# EAGLE design 5403833B (EAGLE 6.6.0)
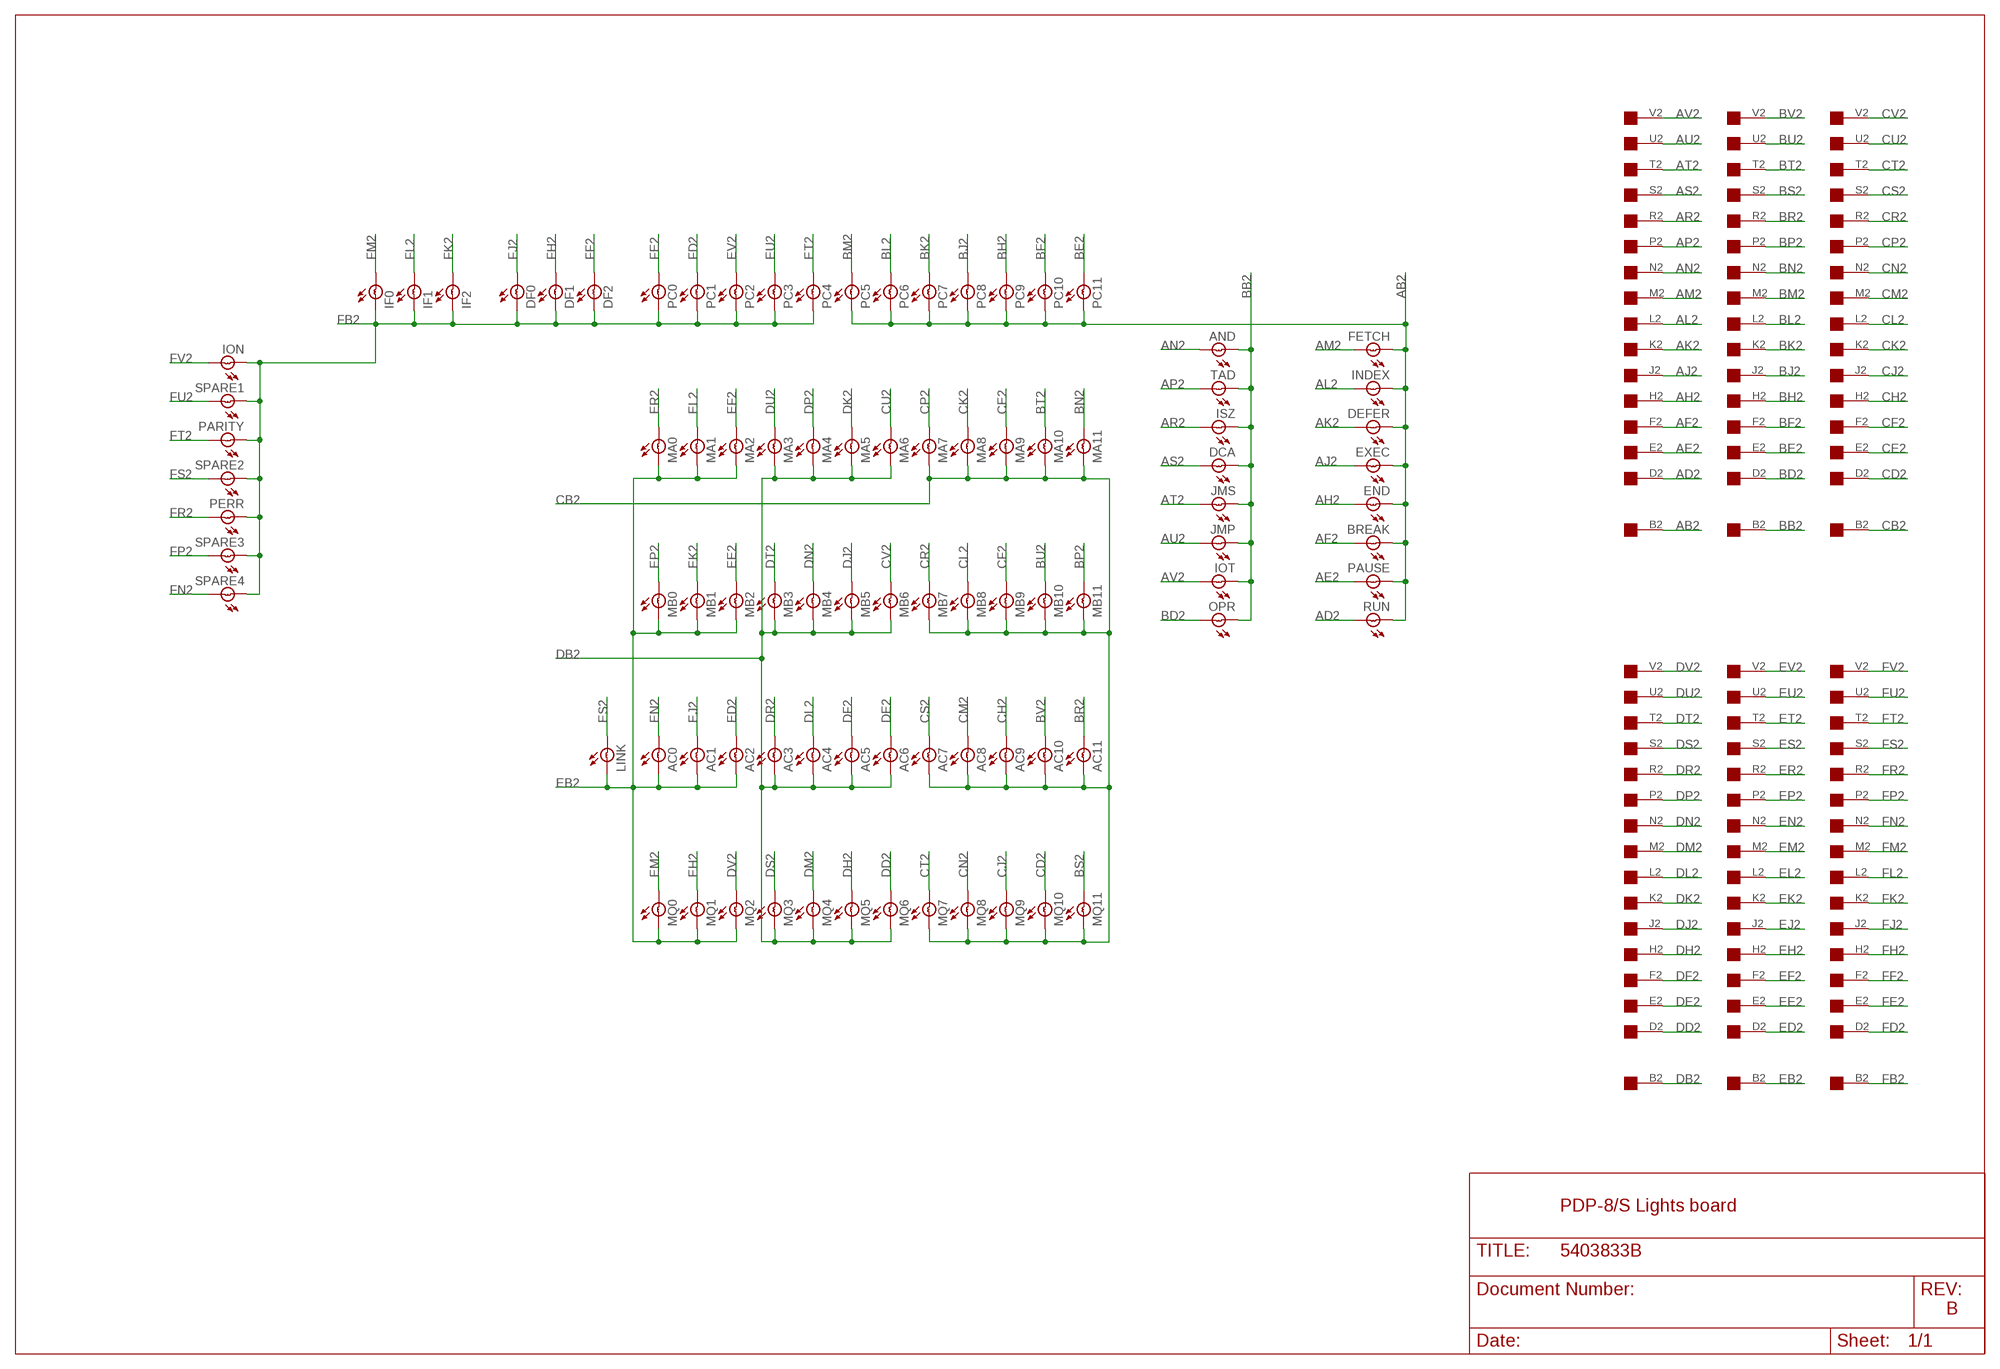
[diagram p0: schematic, sheet 1]

## Parts
A  EDGE-1  [EDGE-CON1]
AC0  BULB  [BULB]
AC1  BULB  [BULB]
AC2  BULB  [BULB]
AC3  BULB  [BULB]
AC4  BULB  [BULB]
AC5  BULB  [BULB]
AC6  BULB  [BULB]
AC7  BULB  [BULB]
AC8  BULB  [BULB]
AC9  BULB  [BULB]
AC10  BULB  [BULB]
AC11  BULB  [BULB]
AND  BULB  [BULB]
B  EDGE-1  [EDGE-CON1]
BREAK  BULB  [BULB]
C  EDGE-1  [EDGE-CON1]
D  EDGE-1  [EDGE-CON1]
DCA  BULB  [BULB]
DEFER  BULB  [BULB]
DF0  BULB  [BULB]
DF1  BULB  [BULB]
DF2  BULB  [BULB]
E  EDGE-1  [EDGE-CON1]
END  BULB  [BULB]
EXEC  BULB  [BULB]
F  EDGE-1  [EDGE-CON1]
FETCH  BULB  [BULB]
IF0  BULB  [BULB]
IF1  BULB  [BULB]
IF2  BULB  [BULB]
INDEX  BULB  [BULB]
ION  BULB  [BULB]
IOT  BULB  [BULB]
ISZ  BULB  [BULB]
JMP  BULB  [BULB]
JMS  BULB  [BULB]
LINK  BULB  [BULB]
MA0  BULB  [BULB]
MA1  BULB  [BULB]
MA2  BULB  [BULB]
MA3  BULB  [BULB]
MA4  BULB  [BULB]
MA5  BULB  [BULB]
MA6  BULB  [BULB]
MA7  BULB  [BULB]
MA8  BULB  [BULB]
MA9  BULB  [BULB]
MA10  BULB  [BULB]
MA11  BULB  [BULB]
MB0  BULB  [BULB]
MB1  BULB  [BULB]
MB2  BULB  [BULB]
MB3  BULB  [BULB]
MB4  BULB  [BULB]
MB5  BULB  [BULB]
MB6  BULB  [BULB]
MB7  BULB  [BULB]
MB8  BULB  [BULB]
MB9  BULB  [BULB]
MB10  BULB  [BULB]
MB11  BULB  [BULB]
MQ0  BULB  [BULB]
MQ1  BULB  [BULB]
MQ2  BULB  [BULB]
MQ3  BULB  [BULB]
MQ4  BULB  [BULB]
MQ5  BULB  [BULB]
MQ6  BULB  [BULB]
MQ7  BULB  [BULB]
MQ8  BULB  [BULB]
MQ9  BULB  [BULB]
MQ10  BULB  [BULB]
MQ11  BULB  [BULB]
OPR  BULB  [BULB]
PARITY  BULB  [BULB]
PAUSE  BULB  [BULB]
PC0  BULB  [BULB]
PC1  BULB  [BULB]
PC2  BULB  [BULB]
PC3  BULB  [BULB]
PC4  BULB  [BULB]
PC5  BULB  [BULB]
PC6  BULB  [BULB]
PC7  BULB  [BULB]
PC8  BULB  [BULB]
PC9  BULB  [BULB]
PC10  BULB  [BULB]
PC11  BULB  [BULB]
PERR  BULB  [BULB]
RUN  BULB  [BULB]
SPARE1  BULB  [BULB]
SPARE2  BULB  [BULB]
SPARE3  BULB  [BULB]
SPARE4  BULB  [BULB]
TAD  BULB  [BULB]

## Nets
AB2: A.B2 BREAK.B DEFER.B END.B EXEC.B FETCH.B INDEX.B PAUSE.B PC5.B PC6.B PC7.B PC8.B PC9.B PC10.B PC11.B RUN.B
AD2: A.D2 RUN.A
AE2: A.E2 PAUSE.A
AF2: A.F2 BREAK.A
AH2: A.H2 END.A
AJ2: A.J2 EXEC.A
AK2: A.K2 DEFER.A
AL2: A.L2 INDEX.A
AM2: A.M2 FETCH.A
AN2: A.N2 AND.A
AP2: A.P2 TAD.A
AR2: A.R2 ISZ.A
AS2: A.S2 DCA.A
AT2: A.T2 JMS.A
AU2: A.U2 JMP.A
AV2: A.V2 IOT.A
BB2: AND.B B.B2 DCA.B IOT.B ISZ.B JMP.B JMS.B OPR.B TAD.B
BD2: B.D2 OPR.A
BE2: B.E2 PC11.A
BF2: B.F2 PC10.A
BH2: B.H2 PC9.A
BJ2: B.J2 PC8.A
BK2: B.K2 PC7.A
BL2: B.L2 PC6.A
BM2: B.M2 PC5.A
BN2: B.N2 MA11.A
BP2: B.P2 MB11.A
BR2: AC11.A B.R2
BS2: B.S2 MQ11.A
BT2: B.T2 MA10.A
BU2: B.U2 MB10.A
BV2: AC10.A B.V2
CB2: AC7.B AC8.B AC9.B AC10.B AC11.B C.B2 MA7.B MA8.B MA9.B MA10.B MA11.B MB7.B MB8.B MB9.B MB10.B MB11.B MQ7.B MQ8.B MQ9.B MQ10.B MQ11.B
CD2: C.D2 MQ10.A
CE2: C.E2 MA9.A
CF2: C.F2 MB9.A
CH2: AC9.A C.H2
CJ2: C.J2 MQ9.A
CK2: C.K2 MA8.A
CL2: C.L2 MB8.A
CM2: AC8.A C.M2
CN2: C.N2 MQ8.A
CP2: C.P2 MA7.A
CR2: C.R2 MB7.A
CS2: AC7.A C.S2
CT2: C.T2 MQ7.A
CU2: C.U2 MA6.A
CV2: C.V2 MB6.A
DB2: AC3.B AC4.B AC5.B AC6.B D.B2 MA3.B MA4.B MA5.B MA6.B MB3.B MB4.B MB5.B MB6.B MQ3.B MQ4.B MQ5.B MQ6.B
DD2: D.D2 MQ6.A
DE2: AC6.A D.E2
DF2: AC5.A D.F2
DH2: D.H2 MQ5.A
DJ2: D.J2 MB5.A
DK2: D.K2 MA5.A
DL2: AC4.A D.L2
DM2: D.M2 MQ4.A
DN2: D.N2 MB4.A
DP2: D.P2 MA4.A
DR2: AC3.A D.R2
DS2: D.S2 MQ3.A
DT2: D.T2 MB3.A
DU2: D.U2 MA3.A
DV2: D.V2 MQ2.A
EB2: AC0.B AC1.B AC2.B E.B2 LINK.B MA0.B MA1.B MA2.B MB0.B MB1.B MB2.B MQ0.B MQ1.B MQ2.B
ED2: AC2.A E.D2
EE2: E.E2 MB2.A
EF2: E.F2 MA2.A
EH2: E.H2 MQ1.A
EJ2: AC1.A E.J2
EK2: E.K2 MB1.A
EL2: E.L2 MA1.A
EM2: E.M2 MQ0.A
EN2: AC0.A E.N2
EP2: E.P2 MB0.A
ER2: E.R2 MA0.A
ES2: E.S2 LINK.A
ET2: E.T2 PC4.A
EU2: E.U2 PC3.A
EV2: E.V2 PC2.A
FB2: DF0.B DF1.B DF2.B F.B2 IF0.B IF1.B IF2.B ION.B PARITY.B PC0.B PC1.B PC2.B PC3.B PC4.B PERR.B SPARE1.B SPARE2.B SPARE3.B SPARE4.B
FD2: F.D2 PC1.A
FE2: F.E2 PC0.A
FF2: DF2.A F.F2
FH2: DF1.A F.H2
FJ2: DF0.A F.J2
FK2: F.K2 IF2.A
FL2: F.L2 IF1.A
FM2: F.M2 IF0.A
FN2: F.N2 SPARE4.A
FP2: F.P2 SPARE3.A
FR2: F.R2 PERR.A
FS2: F.S2 SPARE2.A
FT2: F.T2 PARITY.A
FU2: F.U2 SPARE1.A
FV2: F.V2 ION.A
Unconnected: A.A2 A.C2 B.A2 B.C2 C.A2 C.C2 D.A2 D.C2 E.A2 E.C2 F.A2 F.C2

## Notes on the sheet
- PDP-8/S Lights board
- B

## Library data of the parts
A B C D E F = dec-con:EDGE-1: Single-Sided DEC Edge Connector -- (side 2)
AC0 AC1-AC11 AND BREAK DCA DEFER DF0 DF1 DF2 END EXEC FETCH IF0 IF1 IF2 INDEX ION IOT ISZ JMP JMS LINK MA0 MA1-MA11 MB0 MB1-MB11 MQ0 MQ1-MQ11 OPR PARITY PAUSE PC0 PC1-PC11 PERR RUN SPARE1-SPARE4 TAD = dec-con:BULB: T 1 3/4 Bulb

## Net classes
0 default: width 0.813 mm

## Board
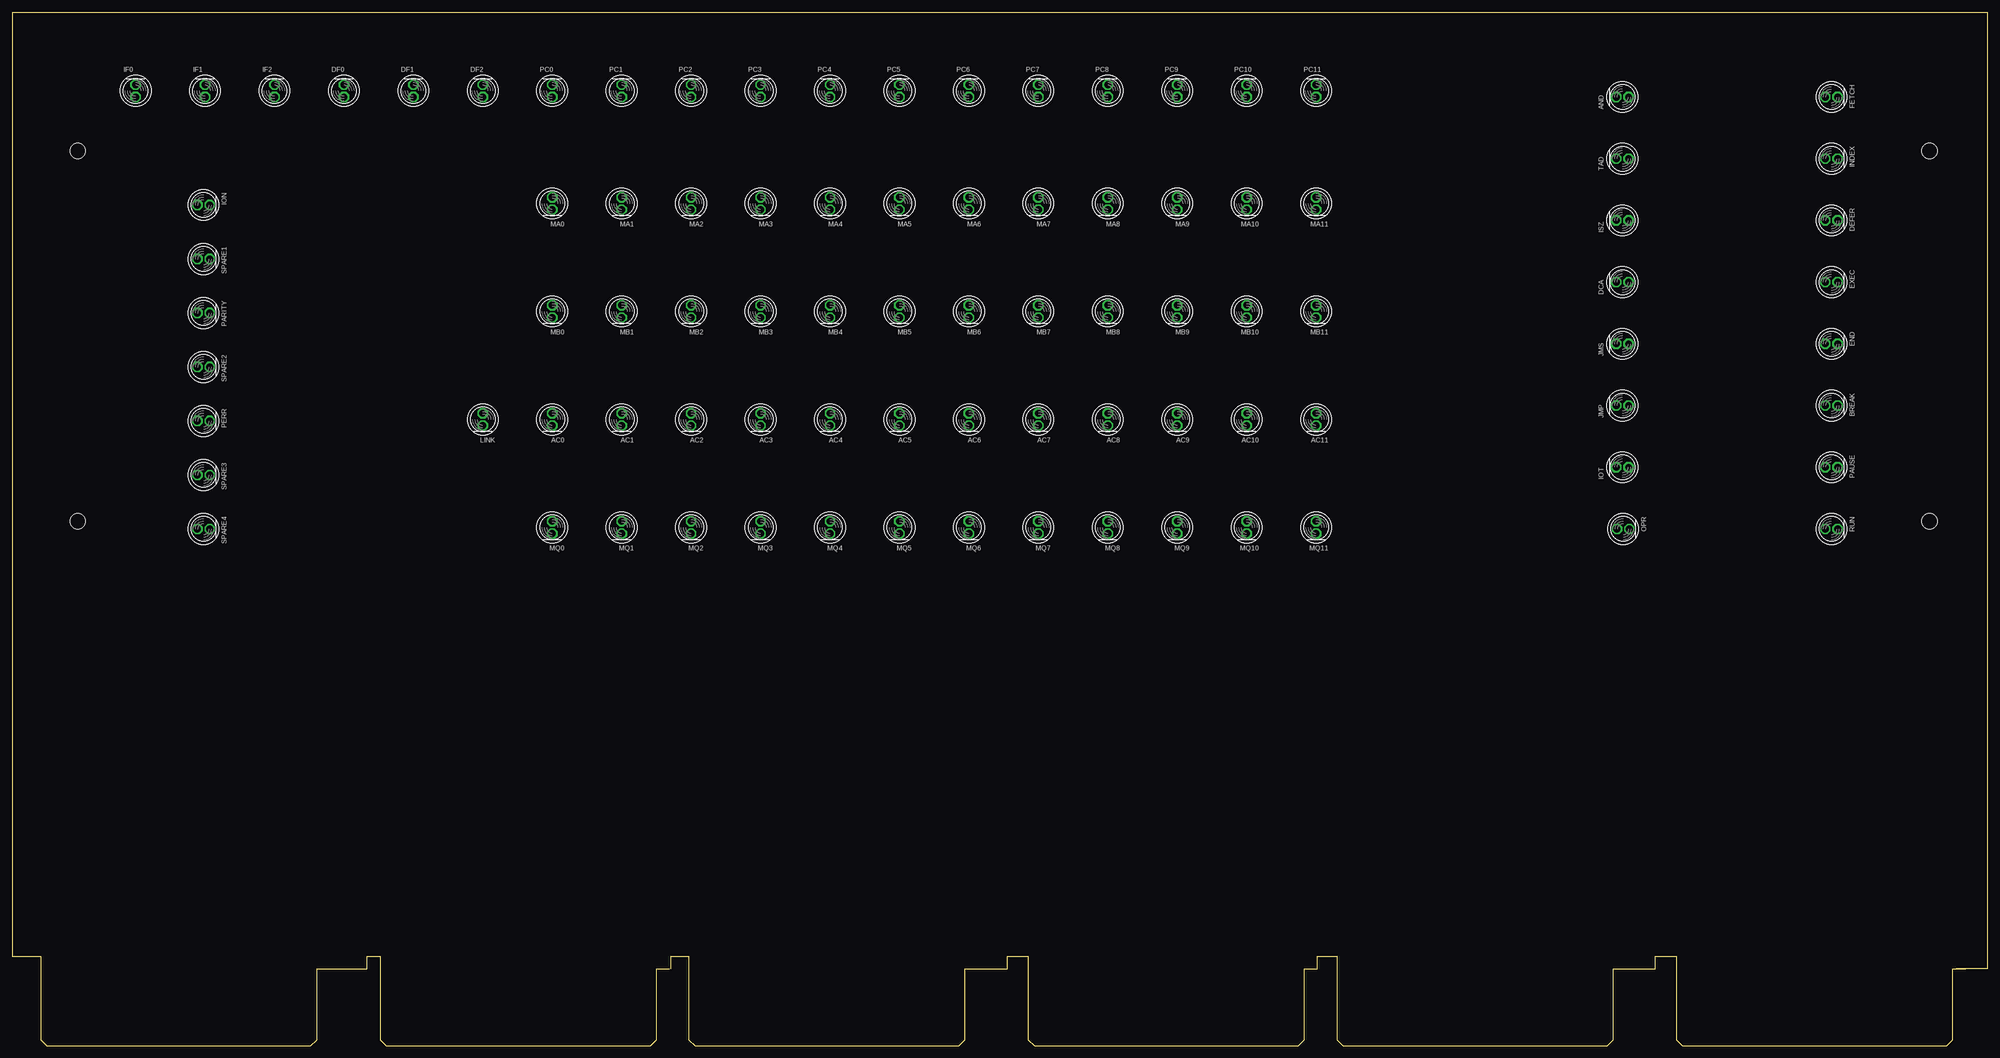
[diagram p1: board, top side]
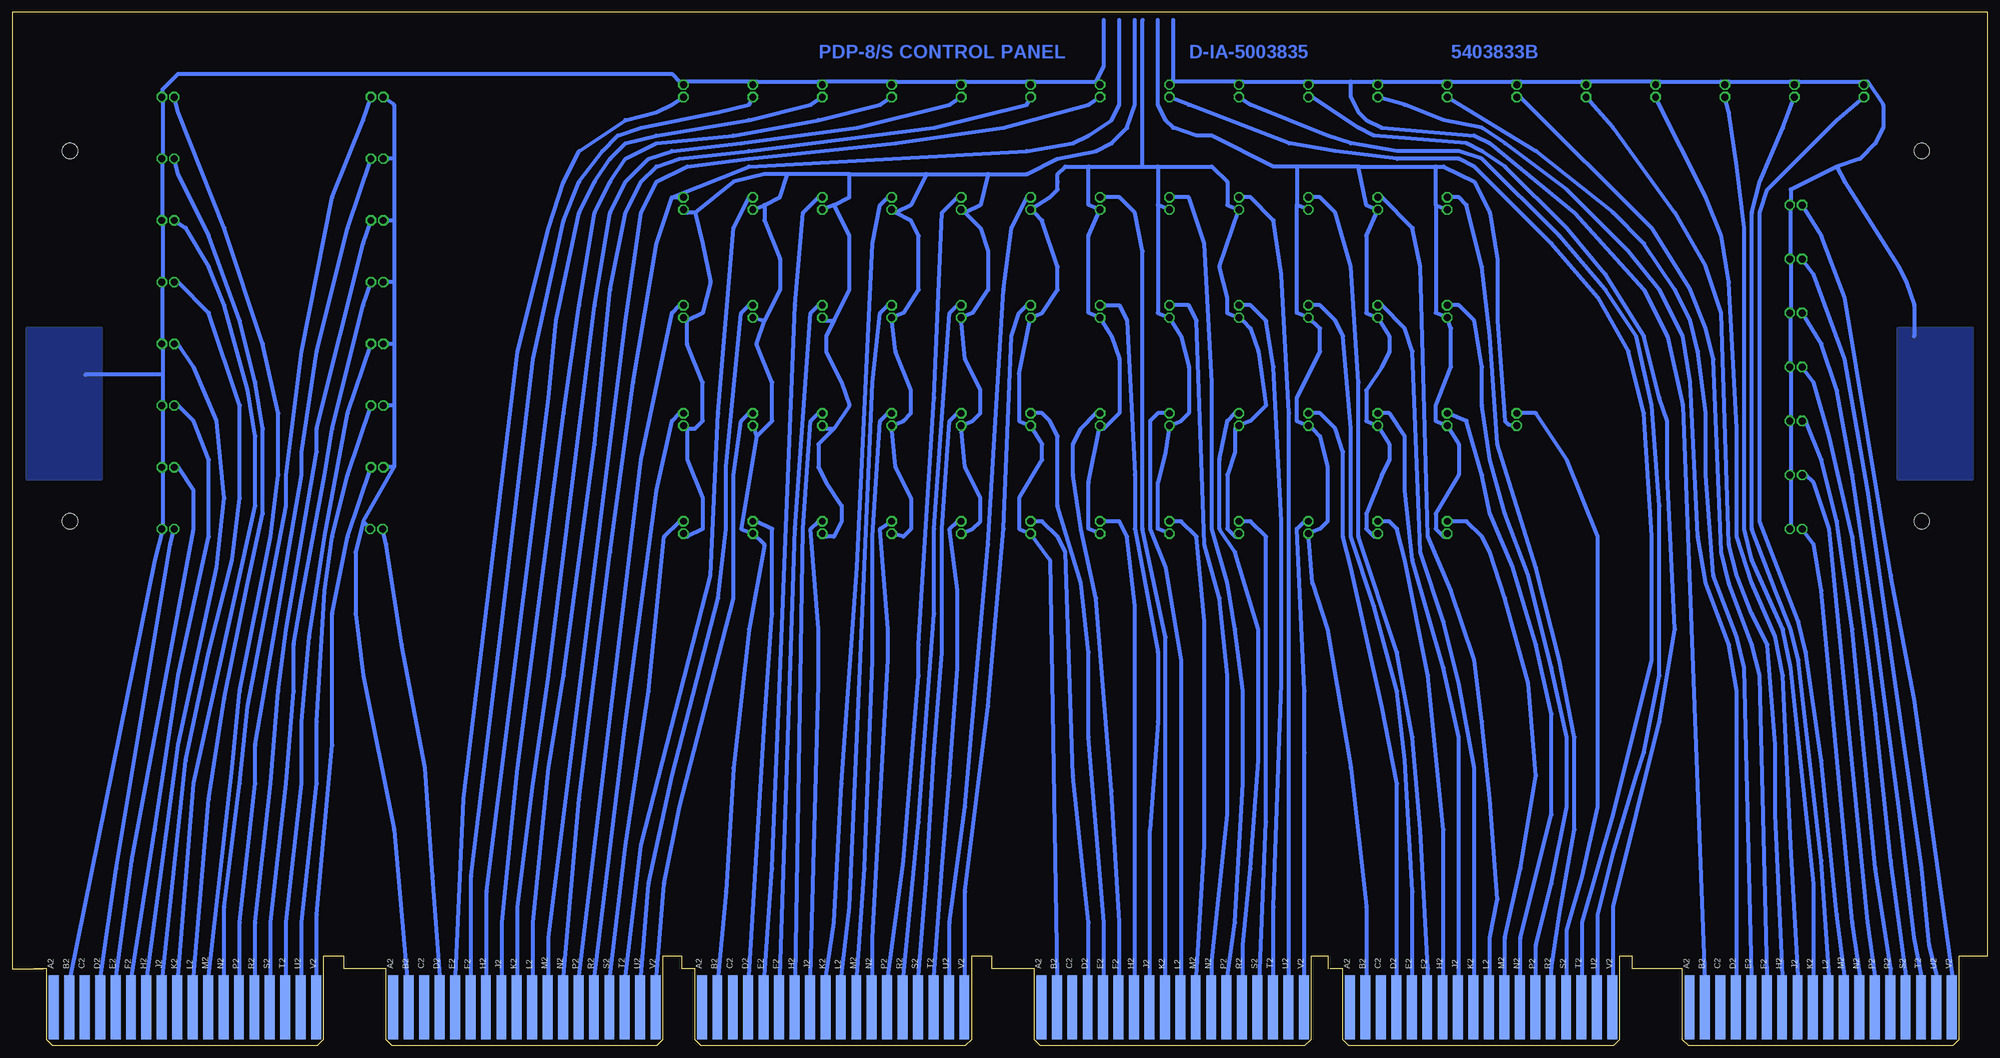
[diagram p2: board, bottom side, seen from below]

Size 406.4 x 212.72 mm. Coordinates in mm from the lower left corner, seen from the top.
Outline: 400.05,15.88 406.4,15.88 406.4,212.72 0,212.72 0,18.41 4.76,18.41
Outline: 138.11,18.41 135.57,18.41 135.57,15.88
Outline: 207.33,18.41 204.79,18.41 204.79,15.88 198.44,15.88
Outline: 270.83,18.41 268.6,18.41 268.6,15.88
Outline: 340.68,18.41 338.14,18.41 338.14,15.88 331.79,15.88
Outline: 73.34,18.41 73.02,18.41 73.02,15.88 65.09,15.88
Copper layers (1+16): Top 0.035mm / dielectric 1.5mm / Bottom 0.035mm
Design rules "16mils *": minimum track width 16mil, minimum drill 32mil, track to track 15mil, track to pad 10mil, pad to pad 10mil, via to via 10mil, smd to smd 10mil, copper to edge 13mil, drill to drill 10mil, minimum pad ring 10mil, minimum via ring 8mil, stop-mask expansion 0mil, vias tented up to drill 0mil, thermal gap 10mil
Holes 3.17 mm at 13.49,107.95 13.49,184.15 394.49,184.15 394.49,107.95

### Footprints (pad centres in the part's own frame; a part is rotated, then mirrored left to right if it is on the bottom)
EDGE-CON1 = smd 13.106 x 2.032 bottom: A2 7.938,4.128; B2 7.938,7.303; C2 7.938,10.477; D2 7.938,13.652; E2 7.938,16.828; F2 7.938,20.003; H2 7.938,23.177; J2 7.938,26.352; K2 7.938,29.527; L2 7.938,32.703; M2 7.938,35.877; N2 7.938,39.053; P2 7.938,42.227; R2 7.938,45.403; S2 7.938,48.578; T2 7.938,51.752; U2 7.938,54.928; V2 7.938,58.102
BULB = drill 1.422 octagon: A 0,0; B 0,2.54

### Placement (x,y rotation side)
A  401.95,0 90 top
AC0  111.12,130.18 180 top
AC1  125.41,130.18 180 top
AC2  139.7,130.18 180 top
AC3  153.99,130.18 180 top
AC4  168.27,130.18 180 top
AC5  182.56,130.18 180 top
AC6  196.85,130.18 180 top
AC7  211.14,130.18 180 top
AC8  225.42,130.18 180 top
AC9  239.71,130.18 180 top
AC10  254,130.18 180 top
AC11  268.29,130.18 180 top
AND  332.58,195.26 90 top
B  332.1,0 90 top
BREAK  373.06,131.76 270 top
C  268.6,0 90 top
D  198.75,0 90 top
DCA  332.58,157.16 90 top
DEFER  373.06,169.86 270 top
DF0  68.26,195.26 0 top
DF1  82.55,195.26 0 top
DF2  96.84,195.26 0 top
E  135.25,0 90 top
END  373.06,144.46 270 top
EXEC  373.06,157.16 270 top
F  65.41,0 90 top
FETCH  373.06,195.26 270 top
IF0  25.4,195.26 0 top
IF1  39.69,195.26 0 top
IF2  53.98,195.26 0 top
INDEX  373.06,182.56 270 top
ION  38.1,173.04 270 top
IOT  332.58,119.06 90 top
ISZ  332.58,169.86 90 top
JMP  332.58,131.76 90 top
JMS  332.58,144.46 90 top
LINK  96.84,130.18 180 top
MA0  111.12,174.62 180 top
MA1  125.41,174.62 180 top
MA2  139.7,174.62 180 top
MA3  153.99,174.62 180 top
MA4  168.27,174.62 180 top
MA5  182.56,174.62 180 top
MA6  196.85,174.62 180 top
MA7  211.14,174.62 180 top
MA8  225.42,174.62 180 top
MA9  239.71,174.62 180 top
MA10  254,174.62 180 top
MA11  268.29,174.62 180 top
MB0  111.12,152.4 180 top
MB1  125.41,152.4 180 top
MB2  139.7,152.4 180 top
MB3  153.99,152.4 180 top
MB4  168.27,152.4 180 top
MB5  182.56,152.4 180 top
MB6  196.85,152.4 180 top
MB7  211.14,152.4 180 top
MB8  225.42,152.4 180 top
MB9  239.71,152.4 180 top
MB10  254,152.4 180 top
MB11  268.29,152.4 180 top
MQ0  111.12,107.95 180 top
MQ1  125.41,107.95 180 top
MQ2  139.7,107.95 180 top
MQ3  153.99,107.95 180 top
MQ4  168.27,107.95 180 top
MQ5  182.56,107.95 180 top
MQ6  196.85,107.95 180 top
MQ7  211.14,107.95 180 top
MQ8  225.42,107.95 180 top
MQ9  239.71,107.95 180 top
MQ10  254,107.95 180 top
MQ11  268.29,107.95 180 top
OPR  330.2,106.36 270 top
PARITY  38.1,150.81 270 top
PAUSE  373.06,119.06 270 top
PC0  111.12,195.26 0 top
PC1  125.41,195.26 0 top
PC2  139.7,195.26 0 top
PC3  153.99,195.26 0 top
PC4  168.27,195.26 0 top
PC5  182.56,195.26 0 top
PC6  196.85,195.26 0 top
PC7  211.14,195.26 0 top
PC8  225.42,195.26 0 top
PC9  239.71,195.26 0 top
PC10  254,195.26 0 top
PC11  268.29,195.26 0 top
PERR  38.1,128.59 270 top
RUN  373.06,106.36 270 top
SPARE1  38.1,161.93 270 top
SPARE2  38.1,139.7 270 top
SPARE3  38.1,117.47 270 top
SPARE4  38.1,106.36 270 top
TAD  332.58,182.56 90 top

### Tracks (layer width: path | path; a pad name or v marks a point on that pad's centre or on a via)
AB2
  Bottom 0.813: 183.36,198.44 196.06,198.44 PC6.B 197.64,198.44 210.34,198.44 PC7.B 211.93,198.44 224.63,198.44 PC8.B 226.22,198.44 238.92,198.44 PC9.B 240.51,198.44 253.21,198.44 PC10.B 254.79,198.44 267.49,198.44 PC11.B 269.08,198.44 270.67,200.03 372.27,200.03 375.44,196.85 375.44,195.26 | 183.36,198.44 PC5.B | 375.44,195.26 375.44,182.56 | 375.44,169.86 375.44,157.16 | 375.44,119.06 375.44,106.36 | 375.44,144.46 375.44,138.11 | 375.44,138.11 375.44,131.76 | 375.44,131.76 375.44,119.06 | 375.44,119.06 PAUSE.B | 375.44,131.76 BREAK.B | 375.44,144.46 375.44,157.16 | 375.44,157.16 EXEC.B | 375.44,144.46 END.B | 375.44,169.86 375.44,182.56 | 375.44,182.56 INDEX.B | 375.44,169.86 DEFER.B | 375.44,106.36 377.03,100.01 394.49,14.29 394.49,7.94 A.B2 | 375.44,106.36 RUN.B | 375.44,195.26 FETCH.B | 183.36,198.44 181.77,201.61 181.77,211.14 | 375.44,138.11 391.32,138.11
  pour Bottom: 388.14,116.68 403.22,116.68 403.22,147.64 388.14,147.64
AD2
  Bottom 0.813: RUN.A 373.86,103.19 384.97,36.51 388.14,14.29 388.14,7.94 A.D2
AE2
  Bottom 0.813: PAUSE.A 372.27,119.06 369.09,114.3 369.09,106.36 381.79,38.1 384.97,14.29 384.97,7.94 A.E2
AF2
  Bottom 0.813: BREAK.A 372.27,131.76 369.09,128.59 365.92,120.65 365.92,104.78 372.27,76.2 377.03,44.45 381.79,14.29 381.79,7.94 A.F2
AH2
  Bottom 0.813: END.A 372.27,144.46 369.09,139.7 364.33,128.59 362.74,112.71 364.33,98.42 372.27,61.91 378.62,14.29 378.62,7.94 A.H2
AJ2
  Bottom 0.813: EXEC.A 372.27,157.16 365.92,150.81 359.57,131.76 359.57,112.71 361.16,100.01 365.92,80.96 370.68,58.74 375.44,14.29 375.44,7.94 A.J2
AK2
  Bottom 0.813: DEFER.A 370.68,168.28 365.92,160.34 362.74,152.4 357.98,134.94 356.39,125.41 356.39,111.12 369.09,53.98 372.27,14.29 372.27,7.94 A.K2
AL2
  Bottom 0.813: INDEX.A 372.27,179.39 365.92,166.69 359.57,149.22 356.39,136.53 354.81,127 354.81,109.54 357.98,95.25 362.74,71.44 365.92,50.8 369.09,14.29 369.09,7.94 A.L2
AM2
  Bottom 0.813: FETCH.A 372.27,192.09 362.74,168.28 354.81,144.46 351.63,130.18 351.63,117.47 353.22,104.78 359.57,73.03 361.16,57.15 365.92,14.29 365.92,7.94 A.M2
AN2
  Bottom 0.813: AND.A 334.17,190.5 340.52,174.62 346.87,142.88 350.04,117.47 350.04,111.12 357.98,69.85 359.57,53.98 362.74,28.57 362.74,7.94 A.N2
AP2
  Bottom 0.813: A.P2 359.57,9.53 359.57,25.4 356.39,53.98 356.39,61.91 346.87,117.47 346.87,122.24 343.69,142.88 337.34,168.28 TAD.A
AR2
  Bottom 0.813: ISZ.A 334.17,165.1 343.69,127 343.69,122.24 350.04,85.72 351.63,73.03 353.22,53.98 356.39,25.4 356.39,7.94 A.R2
AS2
  Bottom 0.813: DCA.A 334.17,152.4 340.52,127 342.11,117.47 346.87,92.08 348.46,82.55 348.46,73.03 350.04,53.98 353.22,25.4 353.22,7.94 A.S2
AT2
  Bottom 0.813: JMS.A 337.34,130.18 342.11,104.78 345.28,84.14 346.87,66.67 346.87,53.98 350.04,25.4 350.04,7.94 A.T2
AU2
  Bottom 0.813: JMP.A 337.34,117.47 340.52,104.78 342.11,93.66 343.69,66.67 343.69,53.98 346.87,25.4 346.87,7.94 A.U2
AV2
  Bottom 0.813: IOT.A 337.34,104.78 340.52,88.9 340.52,61.91 343.69,26.99 343.69,7.94 A.V2
BB2
  Bottom 0.813: AND.B 327.82,193.68 327.82,182.56 | 327.82,182.56 327.82,169.86 | 327.82,119.06 334.17,107.95 | 327.82,169.86 327.82,157.16 | 327.82,157.16 327.82,144.46 | 327.82,144.46 327.82,131.76 | 327.82,131.76 327.82,119.06 | 327.82,119.06 IOT.B | 327.82,131.76 JMP.B | 327.82,144.46 JMS.B | 327.82,157.16 DCA.B | 327.82,169.86 ISZ.B | 334.17,107.95 332.58,106.36 OPR.B | 334.17,107.95 335.76,101.6 335.76,88.9 334.17,76.2 327.82,44.45 324.64,7.94 B.B2 | 327.82,182.56 TAD.B
BD2
  Bottom 0.813: OPR.A 329.41,103.19 326.23,82.55 321.47,57.15 319.88,34.92 318.29,14.29 318.29,7.94 B.D2
BE2
  Bottom 0.813: PC11.A 270.67,193.68 273.84,192.09 280.19,190.5 289.72,184.15 292.89,177.8 296.07,168.28 302.42,142.88 313.53,50.8 315.12,14.29 315.12,7.94 B.E2
BF2
  Bottom 0.813: PC10.A 254.79,193.68 261.14,192.09 277.02,188.91 281.78,187.32 284.96,184.15 289.72,177.8 292.89,169.86 299.24,141.29 305.59,87.31 311.94,34.92 311.94,7.94 B.F2
BH2
  Bottom 0.813: PC9.A 242.09,193.68 254.79,190.5 273.84,187.32 280.19,185.74 283.37,182.56 286.54,177.8 289.72,171.45 294.48,149.22 296.07,133.35 308.77,31.75 308.77,7.94 B.H2
BJ2
  Bottom 0.813: PC8.A 227.81,193.68 240.51,190.5 257.97,187.32 273.84,185.74 280.19,182.56 283.37,177.8 286.54,171.45 289.72,152.4 292.89,130.18 302.42,57.15 305.59,25.4 305.59,7.94 B.J2
BK2
  Bottom 0.813: B.K2 302.42,9.53 302.42,28.57 299.24,53.98 296.07,76.2 286.54,152.4 283.37,171.45 280.19,177.8 275.43,182.56 270.67,184.15 256.38,185.74 232.57,188.91 213.52,193.68 PC7.A
BL2
  Bottom 0.813: B.L2 299.24,9.53 299.24,25.4 296.07,57.15 292.89,76.2 286.54,123.83 283.37,155.57 280.19,171.45 277.02,177.8 273.84,180.97 269.08,182.56 254.79,184.15 216.69,188.91 197.64,193.68 PC6.A
BM2
  Bottom 0.813: B.M2 296.07,9.53 296.07,22.23 280.19,149.22 277.02,171.45 273.84,177.8 267.49,180.97 254.79,182.56 224.63,185.74 202.41,188.91 184.94,193.68 PC5.A
BN2
  Bottom 0.813: 270.67,174.62 273.84,165.1 278.61,136.53 283.37,101.6 289.72,50.8 292.89,14.29 292.89,7.94 B.N2 | 270.67,174.62 MA11.A | 270.67,174.62 254.79,180.97 197.64,184.15 188.12,185.74 184.94,187.32 180.18,190.5 178.59,193.68 178.59,211.14
BP2
  Bottom 0.813: MB11.A 269.08,152.4 270.67,150.81 277.02,120.65 289.72,14.29 289.72,7.94 B.P2
BR2
  Bottom 0.813: AC11.A 269.08,130.18 270.67,128.59 273.84,114.3 280.19,66.67 286.54,14.29 286.54,7.94 B.R2
BS2
  Bottom 0.813: MQ11.A 269.08,107.95 272.26,104.78 275.43,73.03 280.19,41.27 283.37,14.29 283.37,7.94 B.S2
BT2
  Bottom 0.813: MA10.A 254.79,174.62 257.97,168.28 261.14,130.18 262.73,96.84 277.02,41.27 280.19,14.29 280.19,7.94 B.T2
BU2
  Bottom 0.813: MB10.A 254.79,152.4 256.38,150.81 259.56,119.06 259.56,106.36 261.14,92.08 270.67,55.56 275.43,33.34 277.02,14.29 277.02,7.94 B.U2
BV2
  Bottom 0.813: AC10.A 254.79,130.18 256.38,128.59 257.97,117.47 257.97,92.08 269.08,49.21 272.26,33.34 273.84,14.29 273.84,7.94 B.V2
CB2
  Bottom 0.813: MQ8.B 223.04,104.78 221.46,106.36 221.46,112.71 224.63,119.06 AC8.B 223.04,128.59 221.46,130.18 221.46,134.94 224.63,142.88 MB8.B 223.04,150.81 219.87,155.57 219.87,166.69 221.46,169.86 224.63,171.45 | 253.21,125.41 256.38,106.36 MQ10.B 251.62,103.19 254.79,85.72 257.97,57.15 259.56,31.75 261.14,14.29 261.14,7.94 C.B2 | 237.33,127 240.51,123.83 240.51,119.06 238.92,115.89 235.74,111.12 235.74,107.95 237.33,104.78 238.92,104.78 MQ9.B | 237.33,127 238.92,127 AC9.B | 265.91,171.45 267.49,171.45 MA11.B | 237.33,149.22 238.92,146.05 238.92,142.88 235.74,136.53 234.16,131.76 237.33,127 | 237.33,149.22 238.92,149.22 MB9.B | MQ7.B 208.76,106.36 207.17,107.95 207.17,112.71 210.34,119.06 AC7.B 208.76,128.59 207.17,130.18 207.17,134.94 210.34,141.29 MB7.B 208.76,150.81 205.58,155.57 205.58,163.51 207.17,168.28 210.34,171.45 | 237.33,149.22 234.16,155.57 234.16,166.69 237.33,173.04 | 267.49,149.22 264.32,150.81 262.73,157.16 264.32,165.1 265.91,171.45 | 267.49,127 267.49,120.65 264.32,112.71 264.32,106.36 267.49,104.78 MQ11.B | 267.49,127 265.91,127 264.32,128.59 264.32,136.53 267.49,144.46 267.49,149.22 | 267.49,127 AC11.B | 267.49,149.22 MB11.B | 234.16,179.39 246.86,179.39 | 237.33,173.04 234.16,174.62 234.16,179.39 | 205.58,179.39 207.17,173.04 210.34,171.45 | 234.16,179.39 218.28,179.39 | 218.28,179.39 205.58,179.39 | 218.28,179.39 221.46,173.04 224.63,171.45 | 224.63,171.45 MA8.B | 251.62,149.22 253.21,144.46 250.03,136.53 250.03,128.59 253.21,125.41 | 265.91,171.45 257.97,177.8 251.62,179.39 246.86,179.39 | MA10.B 251.62,173.04 | 251.62,173.04 248.44,174.62 246.86,179.39
  Bottom 0.813: 237.33,173.04 MA9.B | 251.62,173.04 251.62,169.86 248.44,161.93 248.44,155.57 251.62,149.22 | MB10.B 251.62,149.22 | AC10.B 253.21,125.41 | 205.58,179.39 197.64,179.39 191.29,182.56 183.36,184.15 180.18,185.74 177.01,188.91 175.42,193.68 175.42,211.14 | 210.34,171.45 MA7.B
CD2
  Bottom 0.813: MQ10.A 253.21,107.95 250.03,106.36 250.03,88.9 251.62,66.67 254.79,14.29 254.79,7.94 C.D2
CE2
  Bottom 0.813: MA9.A 240.51,174.62 243.68,171.45 245.27,152.4 248.44,76.2 250.03,36.51 251.62,14.29 251.62,7.94 C.E2
CF2
  Bottom 0.813: MB9.A 240.51,152.4 242.09,150.81 245.27,106.36 248.44,14.29 248.44,7.94 C.F2
CH2
  Bottom 0.813: AC9.A 240.51,130.18 242.09,128.59 243.68,106.36 245.27,7.94 C.H2
CJ2
  Bottom 0.813: MQ9.A 240.51,107.95 242.09,106.36 240.51,85.72 240.51,74.61 242.09,14.29 242.09,7.94 C.J2
CK2
  Bottom 0.813: MA8.A 226.22,174.62 227.81,173.04 229.39,165.1 232.57,98.42 235.74,53.98 237.33,25.4 238.92,14.29 238.92,7.94 C.K2
CL2
  Bottom 0.813: MB8.A 226.22,152.4 227.81,150.81 229.39,136.53 232.57,63.5 234.16,28.57 235.74,14.29 235.74,7.94 C.L2
CM2
  Bottom 0.813: AC8.A 226.22,130.18 227.81,128.59 229.39,104.78 229.39,79.38 230.98,36.51 232.57,14.29 232.57,7.94 C.M2
CN2
  Bottom 0.813: MQ8.A 227.81,106.36 226.22,85.72 226.22,79.38 229.39,22.23 229.39,7.94 C.N2
CP2
  Bottom 0.813: MA7.A 211.93,174.62 215.11,171.45 216.69,133.35 219.87,82.55 219.87,76.2 223.04,38.1 226.22,14.29 226.22,7.94 C.P2
CR2
  Bottom 0.813: MB7.A 211.93,152.4 213.52,150.81 216.69,106.36 216.69,88.9 218.28,68.26 219.87,46.04 223.04,14.29 223.04,7.94 C.R2
CS2
  Bottom 0.813: AC7.A 211.93,130.18 213.52,128.59 215.11,106.36 215.11,80.96 216.69,60.33 218.28,34.92 219.87,14.29 219.87,7.94 C.S2
CT2
  Bottom 0.813: MQ7.A 211.93,107.95 213.52,106.36 211.93,93.66 211.93,77.79 213.52,55.56 215.11,36.51 216.69,14.29 216.69,7.94 C.T2
CU2
  Bottom 0.813: MA6.A 197.64,174.62 200.82,168.28 202.41,155.57 205.58,103.19 207.17,85.72 210.34,49.21 213.52,25.4 213.52,7.94 C.U2
CV2
  Bottom 0.813: MB6.A 197.64,152.4 199.23,150.81 200.82,146.05 202.41,106.36 205.58,69.85 210.34,31.75 210.34,7.94 C.V2
DB2
  Bottom 0.813: MQ3.B 154.78,104.78 156.37,106.36 156.37,117.47 154.78,122.24 154.78,127 AC3.B 151.61,128.59 148.43,131.76 150.02,142.88 151.61,147.64 153.19,149.22 MB3.B 156.37,150.81 156.37,153.99 157.96,160.34 MA3.B 156.37,173.04 156.37,177.8 159.54,180.97 170.66,180.97 | D.B2 191.29,7.94 192.88,100.01 MQ6.B 199.23,106.36 199.23,112.71 194.47,120.65 194.47,123.83 AC6.B 199.23,128.59 199.23,138.11 MB6.B 194.47,150.81 191.29,155.57 191.29,160.34 194.47,169.86 196.06,171.45 MA6.B 192.88,174.62 191.29,176.21 191.29,177.8 191.29,179.39 189.71,180.97 184.94,180.97 | 170.66,180.97 170.66,173.04 | 170.66,173.04 170.66,150.81 MB4.B 165.89,146.05 164.31,139.7 164.31,130.18 165.89,128.59 AC4.B 169.07,122.24 170.66,115.89 170.66,106.36 MQ4.B | MQ5.B 184.94,106.36 184.94,115.89 AC5.B 181.77,127 178.59,130.18 178.59,141.29 180.18,146.05 MB5.B 184.94,150.81 184.94,166.69 MA5.B 184.94,173.04 184.94,180.97 | 184.94,180.97 173.83,180.97 | 173.83,180.97 170.66,180.97 | MA4.B 170.66,173.04 | 173.83,180.97 173.83,211.14
DD2
  Bottom 0.813: MQ6.A 194.47,107.95 191.29,104.78 189.71,101.6 188.12,55.56 184.94,25.4 184.94,7.94 D.D2
DE2
  Bottom 0.813: AC6.A 194.47,130.18 192.88,128.59 191.29,125.41 191.29,111.12 186.53,95.25 184.94,80.96 184.94,63.5 181.77,25.4 181.77,7.94 D.E2
DF2
  Bottom 0.813: AC5.A 183.36,130.18 186.53,127 188.12,123.83 188.12,117.47 186.53,106.36 183.36,92.08 180.18,52.39 178.59,25.4 178.59,7.94 D.F2
DH2
  Bottom 0.813: MQ5.A 178.59,107.95 177.01,104.78 175.42,90.49 175.42,7.94 D.H2
DJ2
  Bottom 0.813: MB5.A 178.59,152.4 177.01,149.22 175.42,117.47 175.42,106.36 170.66,80.96 170.66,66.67 172.24,44.45 172.24,9.53 D.J2
DK2
  Bottom 0.813: D.K2 169.07,9.53 169.07,84.14 173.83,106.36 173.83,163.51 175.42,171.45 178.59,174.62 MA5.A
DL2
  Bottom 0.813: AC4.A 170.66,130.18 172.24,128.59 172.24,106.36 169.07,98.42 165.89,79.38 165.89,7.94 D.L2
DM2
  Bottom 0.813: MQ4.A 165.89,107.95 162.72,104.78 161.13,87.31 161.13,41.27 162.72,14.29 D.M2
DN2
  Bottom 0.813: MB4.A 164.31,152.4 162.72,149.22 161.13,103.19 157.96,92.08 156.37,76.2 156.37,47.62 159.54,17.46 159.54,7.94 D.N2
DP2
  Bottom 0.813: D.P2 156.37,12.7 156.37,14.29 154.78,25.4 153.19,53.98 153.19,73.03 154.78,85.72 156.37,95.25 159.54,106.36 159.54,136.53 161.13,165.1 164.31,174.62 MA4.A
DR2
  Bottom 0.813: AC3.A 154.78,130.18 156.37,128.59 157.96,120.65 157.96,106.36 154.78,101.6 150.02,85.72 150.02,58.74 151.61,36.51 153.19,20.64 153.19,7.94 D.R2
DS2
  Bottom 0.813: MQ3.A 151.61,107.95 148.43,104.78 148.43,46.04 150.02,7.94 D.S2
DT2
  Bottom 0.813: MB3.A 151.61,152.4 148.43,149.22 146.84,139.7 145.26,107.95 145.26,74.61 146.84,28.57 146.84,7.94 D.T2
DU2
  Bottom 0.813: MA3.A 151.61,174.62 146.84,169.86 145.26,158.75 143.67,130.18 143.67,7.94 D.U2
DV2
  Bottom 0.813: MQ2.A 140.49,107.95 142.08,106.36 140.49,73.03 140.49,60.33 140.49,7.94 D.V2
EB2
  Bottom 0.813: MQ0.B 111.92,104.78 113.51,106.36 113.51,109.54 108.74,117.47 108.74,123.83 AC0.B 113.51,128.59 113.51,131.76 110.33,139.7 110.33,147.64 MB0.B 113.51,150.81 113.51,173.04 | MQ1.B 126.21,104.78 127.79,106.36 127.79,109.54 124.62,117.47 123.03,120.65 123.03,123.83 AC1.B 127.79,128.59 127.79,134.94 124.62,139.7 123.03,142.88 123.03,146.05 MB1.B 127.79,150.81 127.79,166.69 MA1.B 127.79,173.04 129.38,180.97 | E.B2 127.79,7.94 127.79,28.57 130.97,57.15 135.73,85.72 138.91,95.25 MQ2.B 137.32,106.36 135.73,107.95 135.73,119.06 137.32,125.41 138.91,127 AC2.B 142.08,128.59 142.08,133.35 137.32,142.88 137.32,147.64 MB2.B 142.08,150.81 142.08,173.04 | 113.51,173.04 MA0.B | 129.38,180.97 113.51,180.97 | 113.51,180.97 111.92,180.97 105.57,177.8 102.39,171.45 100.81,161.93 100.81,149.22 99.22,128.59 98.42,127.79 LINK.B | 113.51,173.04 113.51,180.97 | MA2.B 142.08,173.04 | 129.38,180.97 142.08,180.97 | 142.08,180.97 142.08,173.04 | 142.08,180.97 146.84,180.97 159.54,187.32 162.72,187.32 167.48,188.91 169.07,190.5 170.66,193.68 170.66,211.14
ED2
  Bottom 0.813: AC2.A 137.32,130.18 134.14,127 132.56,122.24 132.56,104.78 130.97,98.42 124.62,69.85 121.44,53.98 121.44,7.94 E.D2
EE2
  Bottom 0.813: MB2.A 137.32,152.4 134.14,149.22 132.56,146.05 130.97,127 130.97,104.78 126.21,90.49 121.44,73.03 119.86,58.74 118.27,31.75 118.27,7.94 E.E2
EF2
  Bottom 0.813: E.F2 115.09,15.88 116.68,44.45 118.27,63.5 121.44,80.96 129.38,104.78 129.38,136.53 130.97,160.34 134.14,171.45 137.32,174.62 MA2.A
EH2
  Bottom 0.813: MQ1.A 123.03,107.95 121.44,106.36 119.86,100.01 115.09,76.2 111.92,44.45 111.92,7.94 E.H2
EJ2
  Bottom 0.813: AC1.A 123.03,130.18 119.86,125.41 119.86,114.3 118.27,100.01 111.92,77.79 108.74,63.5 108.74,7.94 E.J2
EK2
  Bottom 0.813: MB1.A 124.62,152.4 119.86,147.64 118.27,142.88 116.68,101.6 111.92,87.31 108.74,74.61 105.57,57.15 105.57,7.94 E.K2
EL2
  Bottom 0.813: MA1.A 124.62,174.62 118.27,168.28 116.68,160.34 115.09,104.78 110.33,93.66 105.57,79.38 103.98,66.67 102.39,50.8 100.81,30.16 102.39,22.23 102.39,7.94 E.L2
EM2
  Bottom 0.813: MQ0.A 107.16,107.95 103.98,104.78 102.39,101.6 99.22,92.08 94.46,74.61 92.87,55.56 96.04,36.51 99.22,22.23 99.22,7.94 E.M2
EN2
  Bottom 0.813: AC0.A 107.16,128.59 103.98,117.47 102.39,109.54 97.63,98.42 92.87,82.55 89.69,68.26 89.69,47.62 96.04,22.23 96.04,7.94 E.N2
EP2
  Bottom 0.813: MB0.A 108.74,152.4 105.57,149.22 103.98,139.7 103.98,131.76 102.39,120.65 99.22,109.54 94.46,96.84 89.69,77.79 86.52,63.5 86.52,49.21 89.69,33.34 92.87,20.64 92.87,7.94 E.P2
ER2
  Bottom 0.813: MA0.A 108.74,174.62 107.16,173.04 103.98,160.34 102.39,146.05 100.81,123.83 92.87,98.42 88.11,79.38 84.93,63.5 84.93,44.45 88.11,26.99 89.69,15.88 89.69,7.94 E.R2
ES2
  Bottom 0.813: LINK.A 96.04,130.18 92.87,130.18 86.52,120.65 80.17,104.78 80.17,49.21 83.34,34.92 86.52,23.81 86.52,7.94 E.S2
ET2
  Bottom 0.813: PC4.A 164.31,193.68 143.67,185.74 134.14,184.15 121.44,182.56 108.74,182.56 105.57,180.97 89.69,165.1 80.17,153.99 73.82,142.88 70.64,130.18 69.06,104.78 69.06,79.38 76.99,47.62 83.34,25.4 83.34,7.94 E.T2
EU2
  Bottom 0.813: PC3.A 151.61,193.68 135.73,187.32 130.97,185.74 121.44,184.15 108.74,184.15 103.98,182.56 88.11,166.69 78.58,155.57 72.23,146.05 69.06,131.76 67.47,111.12 67.47,76.2 70.64,60.33 72.23,55.56 76.99,39.69 80.17,26.99 80.17,7.94 E.U2
EV2
  Bottom 0.813: PC2.A 138.91,195.26 129.38,188.91 126.21,187.32 107.16,185.74 103.98,184.15 99.22,180.97 86.52,168.28 78.58,158.75 70.64,146.05 67.47,133.35 65.88,128.59 65.88,117.47 64.29,85.72 67.47,66.67 76.99,28.57 76.99,7.94 E.V2
FB2
  Bottom 0.813: 40.48,161.93 40.48,150.81 | 40.48,161.93 40.48,173.04 | 40.48,161.93 SPARE1.B | 40.48,117.47 40.48,106.36 SPARE4.B | 40.48,139.7 40.48,128.59 | 40.48,128.59 40.48,117.47 | 40.48,117.47 SPARE3.B | 40.48,128.59 PERR.B | 40.48,139.7 40.48,150.81 | 40.48,150.81 PARITY.B | 40.48,139.7 SPARE2.B | 167.48,198.44 154.78,198.44 PC3.B 153.19,198.44 140.49,198.44 PC2.B 138.91,198.44 130.97,198.44 | 167.48,198.44 PC4.B | 24.61,198.44 38.89,198.44 IF1.B 40.48,198.44 53.18,198.44 IF2.B 54.77,198.44 67.47,198.44 DF0.B 69.06,198.44 81.76,198.44 DF1.B 83.34,198.44 96.04,198.44 DF2.B 97.63,198.44 110.33,198.44 PC0.B 111.92,198.44 124.62,198.44 PC1.B 126.21,198.44 130.97,198.44 | 40.48,173.04 40.48,176.21 30.96,180.97 | 30.96,180.97 26.19,182.56 23.02,185.74 21.43,188.91 21.43,193.68 24.61,198.44 | 40.48,173.04 ION.B | 24.61,198.44 IF0.B | F.B2 57.94,7.94 62.71,131.76 65.88,146.05 70.64,155.57 84.93,171.45 102.39,185.74 105.57,187.32 124.62,188.91 127.79,190.5 129.38,192.09 130.97,195.26 130.97,198.44 | 30.96,180.97 29.37,177.8 18.26,160.34 16.67,157.16 15.08,152.4 15.08,146.05 | 167.48,198.44 167.48,211.14
  pour Bottom: 3.17,116.68 18.26,116.68 18.26,147.64 3.17,147.64
FD2
  Bottom 0.813: PC1.A 119.86,193.68 111.92,190.5 103.98,188.91 99.22,185.74 86.52,176.21 73.82,163.51 67.47,155.57 62.71,146.05 61.12,136.53 59.53,104.78 57.94,95.25 53.18,82.55 51.59,73.03 51.59,7.94 F.D2
FE2
  Bottom 0.813: PC0.A 92.87,184.15 76.99,171.45 70.64,165.1 64.29,155.57 61.12,149.22 59.53,142.88 57.94,130.18 57.94,117.47 56.36,96.84 51.59,84.14 50.01,77.79 48.42,14.29 48.42,7.94 F.E2
FF2
  Bottom 0.813: DF2.A 96.04,195.26 69.06,168.28 61.12,155.57 57.94,147.64 56.36,141.29 54.77,101.6 53.18,95.25 48.42,82.55 46.83,76.2 45.24,14.29 45.24,7.94 F.F2
FH2
  Bottom 0.813: DF1.A 76.99,188.91 64.29,171.45 57.94,160.34 54.77,150.81 53.18,103.19 51.59,96.84 48.42,88.9 45.24,82.55 43.66,61.91 43.66,47.62 42.07,14.29 42.07,7.94 F.H2
FJ2
  Bottom 0.813: DF0.A 57.94,174.62 54.77,166.69 53.18,157.16 51.59,127 51.59,104.78 48.42,95.25 43.66,84.14 42.07,76.2 40.48,41.27 38.89,14.29 38.89,7.94 F.J2
FK2
  Bottom 0.813: IF2.A 53.18,192.09 51.59,180.97 50.01,168.28 50.01,106.36 48.42,100.01 42.07,85.72 40.48,77.79 35.72,33.34 35.72,7.94 F.K2
FL2
  Bottom 0.813: IF1.A 42.07,188.91 46.83,177.8 48.42,171.45 48.42,106.36 43.66,93.66 40.48,85.72 38.89,79.38 34.13,38.1 32.54,14.29 32.54,7.94 F.L2
FM2
  Bottom 0.813: IF0.A 30.96,190.5 45.24,176.21 46.83,171.45 46.83,107.95 38.89,87.31 37.31,80.96 34.13,58.74 30.96,26.99 29.37,14.29 29.37,7.94 F.M2
FN2
  Bottom 0.813: SPARE4.A 35.72,103.19 34.13,93.66 27.78,25.4 26.19,14.29 26.19,7.94 F.N2
FP2
  Bottom 0.813: SPARE3.A 37.31,117.47 35.72,115.89 32.54,106.36 24.61,25.4 23.02,14.29 23.02,7.94 F.P2
FR2
  Bottom 0.813: PERR.A 37.31,128.59 34.13,120.65 30.96,107.95 27.78,85.72 23.02,36.51 19.84,15.88 19.84,7.94 F.R2
FS2
  Bottom 0.813: SPARE2.A 35.72,136.53 32.54,125.41 27.78,104.78 24.61,80.96 23.02,68.26 19.84,38.1 16.67,14.29 16.67,7.94 F.S2
FT2
  Bottom 0.813: PARITY.A 34.13,144.46 30.96,134.94 27.78,117.47 23.02,85.72 18.26,49.21 15.08,22.23 13.49,14.29 13.49,7.94 F.T2
FU2
  Bottom 0.813: SPARE1.A 35.72,158.75 29.37,141.29 24.61,114.3 13.49,36.51 11.91,20.64 10.32,14.29 10.32,7.94 F.U2
FV2
  Bottom 0.813: ION.A 34.13,166.69 29.37,153.99 19.84,96.84 15.08,71.44 7.14,14.29 7.14,7.94 F.V2

### Text on the board
Bottom: 5403833B | D-IA-5003835 | PDP-8/S CONTROL PANEL